# Altium project PCB_Project_SSSSH_1.PrjPcb
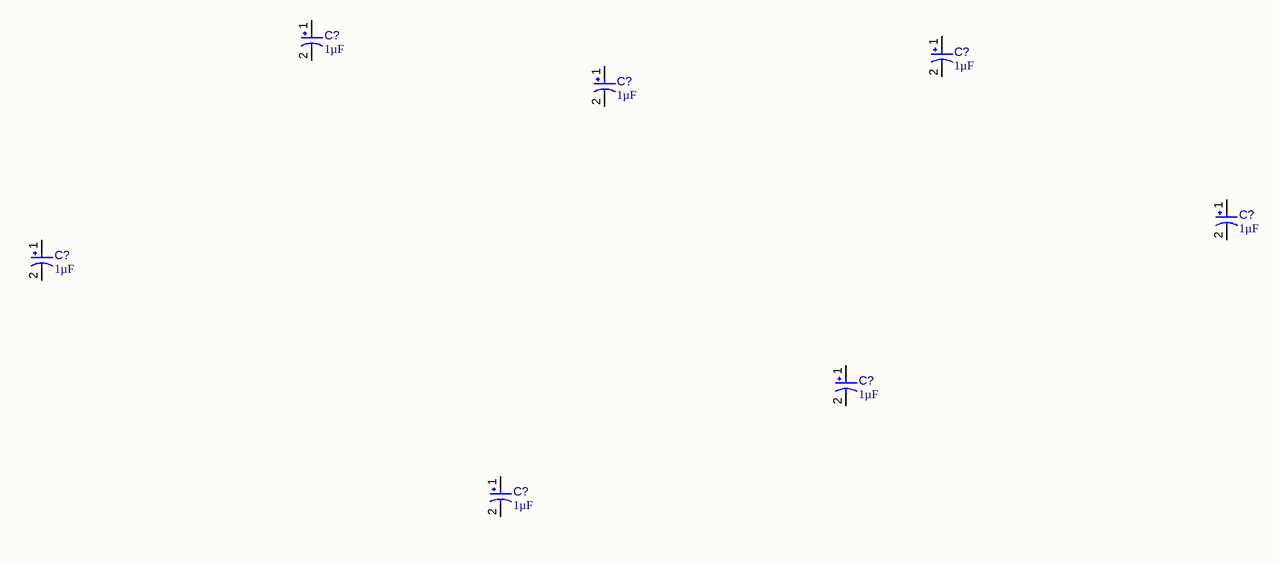
[diagram p0: Sheet1.SchDoc]
CAGE_CODE: ?????; CONTRACT_NUMBER: <CONTRACT NO>; DOC_NO_ASSY_DWG: <ASSY DWG NO>; DOC_NO_BOM: <BOM DOC NO>; DOC_NO_FAB_DWG: <FAB DWG NO>; DOC_NO_SCH_DWG: <SCH DWG NO>; PCB_2_DEC_TOL: +/-.01; PCB_3_DEC_TOL: +/-.010; PCB_ANG_TOL: +/-1/2; PCB_ASSEMBLY_NO: <PCB ASSY NO>; PCB_CHECKER: - -----; PCB_CHECKER_APP_DATE: --/--/----; PCB_DESIGNER: - -----; PCB_DESIGNER_APP_DATE: --/--/----; PCB_DWG_NO: <PCB DWG NO>; PCB_ENGINEER: - -----; PCB_ENGINEER_APP_DATE: --/--/----; PCB_PART_NUMBER: <PCB PN>; PCB_REV: A; SCH_REV: A
1 sheet, 7 parts. Net scope: global (net labels, ports and power ports of the same name join across sheets).
Board file: PCB1.PcbDoc

## Sheet Sheet1.SchDoc
size 431 x 279 mm; SheetNumber: 1; SheetTotal: 1; ENG_APP_DATE: --/--/--; DSN_APP_DATE: --/--/--; CHK_APP_DATE: --/--/--

### Parts
(Parts that share a designator on the sheet are numbered #1, #2 ... from top to bottom, then left to right.)
C?#1  value 1µF  [CAPMP3217X18-T_V]  (hidden comment: TAJA105K035RNJ)
C?#2  value 1µF  [CAPMP3217X18-T_V]  (hidden comment: TAJA105K035RNJ)
C?#3  value 1µF  [CAPMP3217X18-T_V]  (hidden comment: TAJA105K035RNJ)
C?#4  value 1µF  [CAPMP3217X18-T_V]  (hidden comment: TAJA105K035RNJ)
C?#5  value 1µF  [CAPMP3217X18-T_V]  (hidden comment: TAJA105K035RNJ)
C?#6  value 1µF  [CAPMP3217X18-T_V]  (hidden comment: TAJA105K035RNJ)
C?#7  value 1µF  [CAPMP3217X18-T_V]  (hidden comment: TAJA105K035RNJ)

### Nets

Not connected (* = marked no-connect by the designer): C?#1 1 2; C?#2 1 2; C?#3 1 2; C?#4 1 2; C?#5 1 2; C?#6 1 2; C?#7 1 2

### Notes on the sheet
- DWG. NO.
- REV.
- SHT.
- THIS DOCUMENT AND THE DATA DISCLOSED HEREIN OR HEREWITH IS THE PROPERTY OF ALTIUM LIMITED AND MAY BE FREELY DISTRIBUTED IN WHOLE. NO RIGHTS ARE RESERVED OR EXPRESS OR IMPLIED WARANTEE GIVEN.
- REVISION
- DESCRIPTION
- DATE
- APPROVED
- ENG:
- APPROVALS
- PROJECT
- DSN:
- CHK:
- REFERENCE DOCUMENTS
- PROJECT REVISION:
- TITLE
- DOCUMENT REVISION:
- DESIGN ITEM:
- BOM:
- FAB DWG:
- PCB DWG:
- ASSY DWG:
- SCALE:
- SIZE
- B
- CAGE CODE
- FILE NAME
- DWG NO.
- SHEET
- OF
- REV

### Library data of the parts
C?#1-C?#7 = CMP-001-00040-6: Standard Tantalum, 1 uF, +/- 10%, 35 V, -55 to 125 degC, 1206 (3216 Metric), RoHS, Tape and Reel; Manufacturer: AVX; ESR: 7.5Ohm; Voltage Rating: 35V; Mounting Technology: SM; Package Reference: CAPMP3217X18-T; Package URL: http://www.avx.com/download/software/literature/AVX-Footprint-Library.pdf; Manufacturer URL: http://www.avx.com/; Packaging: TapeandReel; Min Operating Temperature: -55°C; Package Description: 2-Pin Surface Mount Device, Body 3.2 x 1.65 mm; Datasheet Version: Feb-16; Max Operating Temperature: 125°C; Resistance: 7.5Ohm; Capacitor Type: Tantalum; Package Quantity: 2000; Tolerance: 10%; RoHS Compliant: True; Pins: 2; Datasheet URL: http://datasheets.avx.com/TAJ.pdf; Case/Package: 1206